# Altium project CH340G.PrjPCB
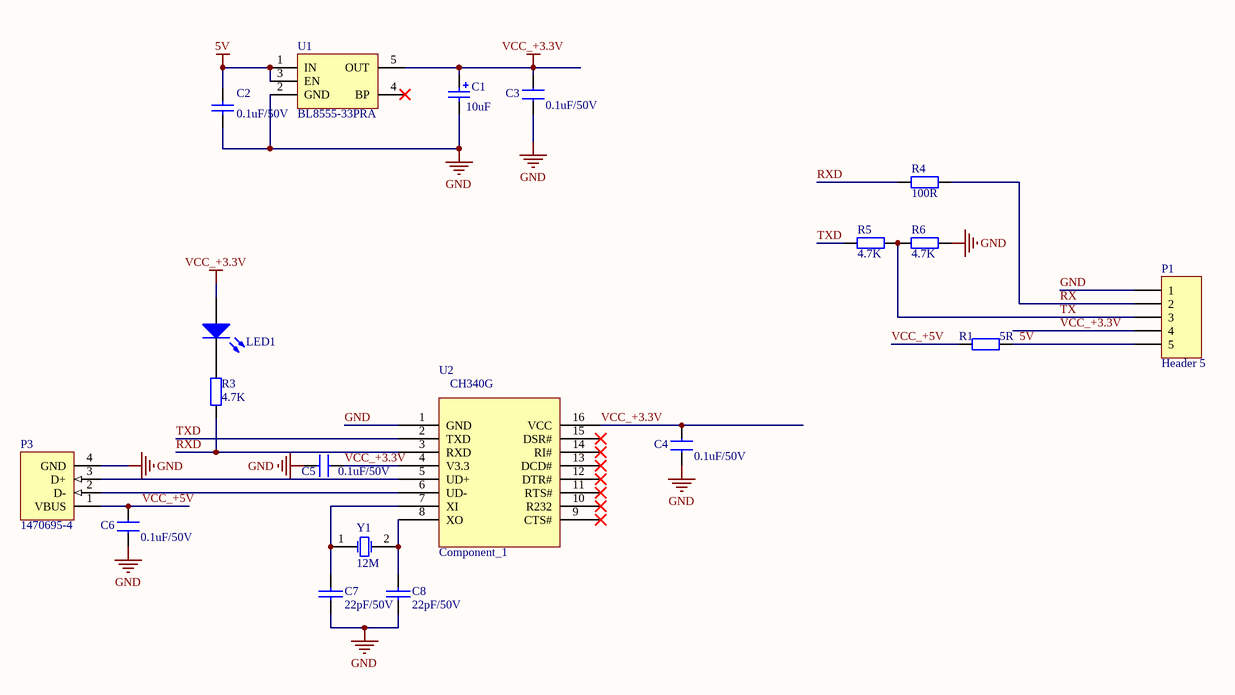
[diagram p0: CH340G.SchDoc]
1 sheet, 19 parts. Net scope: global (net labels, ports and power ports of the same name join across sheets).
Board file: CH340G.PcbDoc

## Sheet CH340G.SchDoc
size A4

### Parts
C1  10uF  [1206-C]
C2  0.1uF/50V  [0603C]
C3  0.1uF/50V  [0603C]
C4  0.1uF/50V  [0603C]
C5  0.1uF/50V  [0603C]
C6  0.1uF/50V  [0603C]
C7  22pF/50V  [0603C]
C8  22pF/50V  [0603C]
LED1  LED  [LED-0603]  (value not drawn)
P1  Header 5  [HDR1X5]
P3  1470695-4  [USB1019]
R1  5R  [1206R]
R3  4.7K  [0603R]
R4  100R  [0603R]
R5  4.7K  [0603R]
R6  4.7K  [0603R]
U1  BL8555-33PRA  [SOT23-5]
U2  Component_1  [SO-16]
Y1  12M  [XTAL]

### Nets
5V: C2.2 P1.5 R1.2 U1.1(IN) U1.3(EN)
GND: C1.2 C2.1 C3.2 C4.2 C5.1 C6.2 C7.1 C8.1 P1.1 P3.4(GND) R6.1 U1.2(GND) U2.1(GND)
VCC_+3.3V: C1.1 C3.1 C4.1 C5.2 LED1.1(A) P1.4 U1.5(OUT) U2.4(V3.3) U2.16(VCC)
RX: P1.2 R4.2
RXD: R3.2 R4.1 U2.3(RXD)
TX: P1.3 R5.2 R6.2
TXD: R5.1 U2.2(TXD)
VCC_+5V: C6.1 P3.1(VBUS) R1.1
NetC7_2: C7.2 U2.7(XI) Y1.1(OSC1)
NetC8_2: C8.2 U2.8(XO) Y1.2(OSC2)
NetLED1_2: LED1.2(K) R3.1
NetP3_2: P3.2(D-) U2.6(UD-)
NetP3_3: P3.3(D+) U2.5(UD+)

Not connected (* = marked no-connect by the designer): U1 4(BP)*; U2 9(CTS#)* 10(R232)* 11(RTS#)* 12(DTR#)* 13(DCD#)* 14(RI#)* 15(DSR#)*

### Notes on the sheet
- (in symbol Component_1) CH340G

### Library data of the parts
C1 = Cap Pol: Polarized Capacitor (Radial); Published: 8-Jun-2000; LatestRevisionDate: 17-Jul-2002; LatestRevisionNote: Re-released for DXP Platform.; Publisher: Altium Limited; Value: 10uF
C2 = Cap: Capacitor; Value: 104; Published: 8-Jun-2000; LatestRevisionDate: 17-Jul-2002; LatestRevisionNote: Re-released for DXP Platform.; Publisher: Altium Limited
C3-C6 = CAP
C7 C8 = 0603C
LED1 = LED3: BLUE LED; Published: 8-Jun-2000; LatestRevisionDate: 17-Dec-2003; LatestRevisionNote: PCB Footprint replaced.; DatasheetDocument: 16-Apr-2002; PackageDocument: 16-Apr-2002; PackageReference: 3.5X2.8X1.9; Publisher: Altium Limited
P1 = Header 5: Header, 5-Pin; LatestRevisionDate: 17-Jul-2002; LatestRevisionNote: Re-released for DXP Platform.; Publisher: Altium Limited
P3 = 1470695-4: USB 1.1, Right Angle, SMT, A Type, Plug, 4 Position, Black; ContactMaterial: Brass; ContactPlating: Gold (30) over Nickel (50); PCB_Layout: Complies with manufacturer's recommendation.; DrillSize: Corresponds to nominal value.; PanelGround: Without; Published: 15-Jul-2004; DatasheetDocument: 21-Jan-2003; PackageDocument: 21-Jan-2003; PackageReference: 1470695A; Publisher: Altium Limited; HousingMaterial: Thermoplastic
R1 R3-R6 = 0603R
U1 = SGM2019
Y1 = XTAL: Crystal Oscillator; Published: 8-Jun-2000; LatestRevisionDate: 17-Jul-2002; LatestRevisionNote: Re-released for DXP Platform.; PackageReference: R38; Publisher: Altium Limited